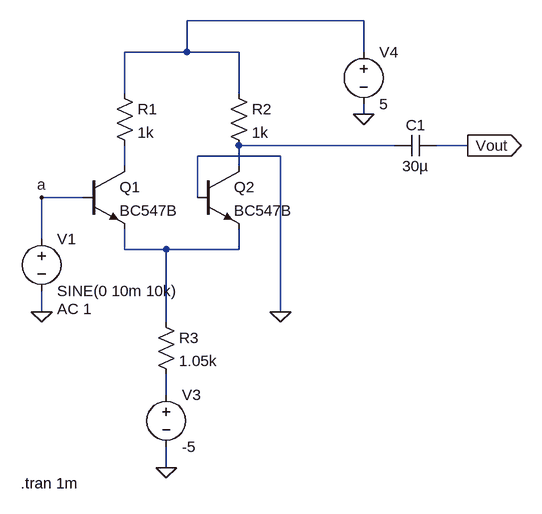
[diagram p0: schematic pre-amp.asc]
pre-amp.asc, the LTspice schematic file:
Version 4.1
SHEET 1 880 680
WIRE 512 -256 240 -256
WIRE 240 -208 240 -256
WIRE 240 -208 144 -208
WIRE 320 -208 240 -208
WIRE 512 -208 512 -256
WIRE 144 -144 144 -208
WIRE 320 -144 320 -208
WIRE 512 -112 512 -128
WIRE 560 -64 320 -64
WIRE 672 -64 624 -64
WIRE 384 -48 256 -48
WIRE 144 -32 144 -64
WIRE 320 -32 320 -64
WIRE 80 16 16 16
WIRE 256 16 256 -48
WIRE 16 80 16 16
WIRE 144 96 144 64
WIRE 208 96 144 96
WIRE 320 96 320 64
WIRE 320 96 208 96
WIRE 16 192 16 160
WIRE 384 192 384 -48
WIRE 208 208 208 96
WIRE 208 320 208 288
WIRE 208 432 208 400
FLAG 384 192 0
FLAG 16 192 0
FLAG 208 432 0
FLAG 512 -112 0
FLAG 672 -64 Vout
IOPIN 672 -64 Out
FLAG 16 16 a
SYMBOL voltage 16 64 R0
WINDOW 123 24 124 Left 2
WINDOW 39 0 0 Left 0
SYMATTR Value2 AC 1
SYMATTR InstName V1
SYMATTR Value SINE(0 10m 10k)
SYMBOL res 128 -160 R0
SYMATTR InstName R1
SYMATTR Value 1k
SYMBOL res 304 -160 R0
SYMATTR InstName R2
SYMATTR Value 1k
SYMBOL res 192 192 R0
SYMATTR InstName R3
SYMATTR Value 1.05k
SYMBOL npn 80 -32 R0
SYMATTR InstName Q1
SYMATTR Value BC547B
SYMBOL npn 256 -32 R0
SYMATTR InstName Q2
SYMATTR Value BC547B
SYMBOL voltage 208 304 R0
WINDOW 123 0 0 Left 0
WINDOW 39 0 0 Left 0
SYMATTR InstName V3
SYMATTR Value -5
SYMBOL voltage 512 -224 R0
WINDOW 123 0 0 Left 0
WINDOW 39 0 0 Left 0
SYMATTR InstName V4
SYMATTR Value 5
SYMBOL cap 624 -80 R90
WINDOW 0 0 32 VBottom 2
WINDOW 3 32 32 VTop 2
SYMATTR InstName C1
SYMATTR Value 30µ
TEXT -16 456 Left 2 !.tran 1m

The netlist it stands for:
* pre-amp.asc
V1 a 0 SINE(0 10m 10k) AC 1
R1 N001 N003 1k
R2 N001 N002 1k
R3 N004 N005 1.05k
Q1 N003 a N004 0 BC547B
Q2 N002 0 N004 0 BC547B
V3 N005 0 -5
V4 N001 0 5
C1 Vout N002 30µ
.model NPN NPN
.model PNP PNP
.lib standard.bjt
.tran 1m
.backanno
.end